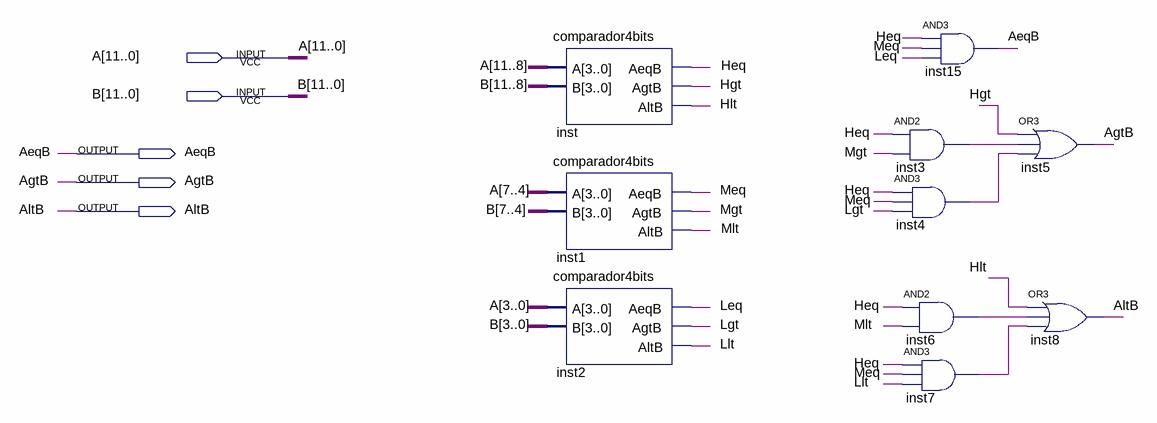
[diagram p0: schematic sheet]
// Quartus schematic comparador12bits.bdf as structural Verilog: 10 symbols, 5 pins
module comparador12bits (
  input  [11:0] A,
  input  [11:0] B,
  output AeqB,
  output AgtB,
  output AltB
);

  wire Heq, Hgt, Hlt, inst3_out, inst4_out, inst6_out, inst7_out, Leq, Lgt, Llt, Meq, Mgt, Mlt;

  comparador4bits inst (.A(A[11:8]), .B(B[11:8]), .AeqB(Heq), .AgtB(Hgt), .AltB(Hlt));
  comparador4bits inst1 (.A(A[7:4]), .B(B[7:4]), .AeqB(Meq), .AgtB(Mgt), .AltB(Mlt));
  comparador4bits inst2 (.A(A[3:0]), .B(B[3:0]), .AeqB(Leq), .AgtB(Lgt), .AltB(Llt));
  and inst3 (inst3_out, Heq, Mgt);
  and inst4 (inst4_out, Heq, Meq, Lgt);
  and inst15 (AeqB, Heq, Meq, Leq);
  and inst6 (inst6_out, Heq, Mlt);
  and inst7 (inst7_out, Heq, Meq, Llt);
  or inst5 (AgtB, Hgt, inst3_out, inst4_out);
  or inst8 (AltB, Hlt, inst6_out, inst7_out);
endmodule
